# Altium schematic sheet BAI1.SchDoc
size A; SheetNumber: 1; SheetTotal: 1
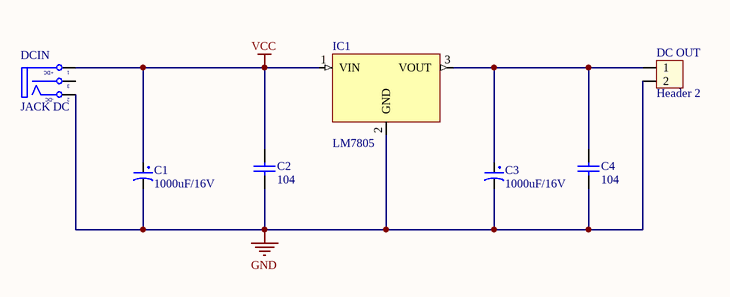
[diagram p0: BAI1.SchDoc]

## Parts
C1  1000uF/16V  [CP1.5/3.4]
C2  104  [CAP104]
C3  1000uF/16V  [CP1.5/3.4]
C4  104  [CAP104]
DC_OUT  Header 2  [Header 2P DC 2.54]
DCIN  JACK DC  [DC-IN]
IC1  LM7805  [TO-220]

## Nets
GND: C1.2 C2.1 C3.2 C4.1 DC_OUT.2 DCIN.2(TN) IC1.2(GND)
VCC: C1.1 C2.2 DCIN.1(T) IC1.1(VIN)
NetC3_1: C3.1 C4.2 DC_OUT.1 IC1.3(VOUT)

Not connected (* = marked no-connect by the designer): DCIN 3(S)

## Notes on the sheet
- (in symbol DCIN) +DC; -DC

## Library data of the parts
C1 C3 = CP4: Cap 1000uF/16V - 220uF/50V; Description 5: 4,7uF>10uF/250V_3,3uF>10uF/400V - 2,2uF>4,7uF/450V; Description 1: 2200uF-3300uF/6,3V - 1000uF-2200uF/10V; Description 2: 1000uF/16V - 470uF => 1000uF/25V - 100uF/100V; Description 3: 330uF>470uF/35V_220uF>470uF/50V_10uF>22uF/250V; Description 4: 220uF => 330uF/63V - 10uF =>33uF/160 - 200V; Value: 1000uF/16V
C2 C4 = Cap 104: Capacitor (Semiconductor SIM Model); Value: 0.1uF; Published: 8-Jun-2000; LatestRevisionDate: 17-Jul-2002; LatestRevisionNote: Re-released for DXP Platform.; PackageReference: C1206; Publisher: Altium Limited
DC_OUT = Header 2P 2.54 Duc Cong: Cắm; Ten_Linh_Kien: Header 2P XH2.54-2P Đực Cong; Don_Vi: Con; Ma_Hang: MH002852; Chung_Loai: Cắm
DCIN = DCIN: Jac DC input; Value: Jac DC
IC1 = LM7805: TO-220; Text Field1: 70; Text Field2: 30